# EAGLE schematic schem1 (EAGLE 8.6.0)
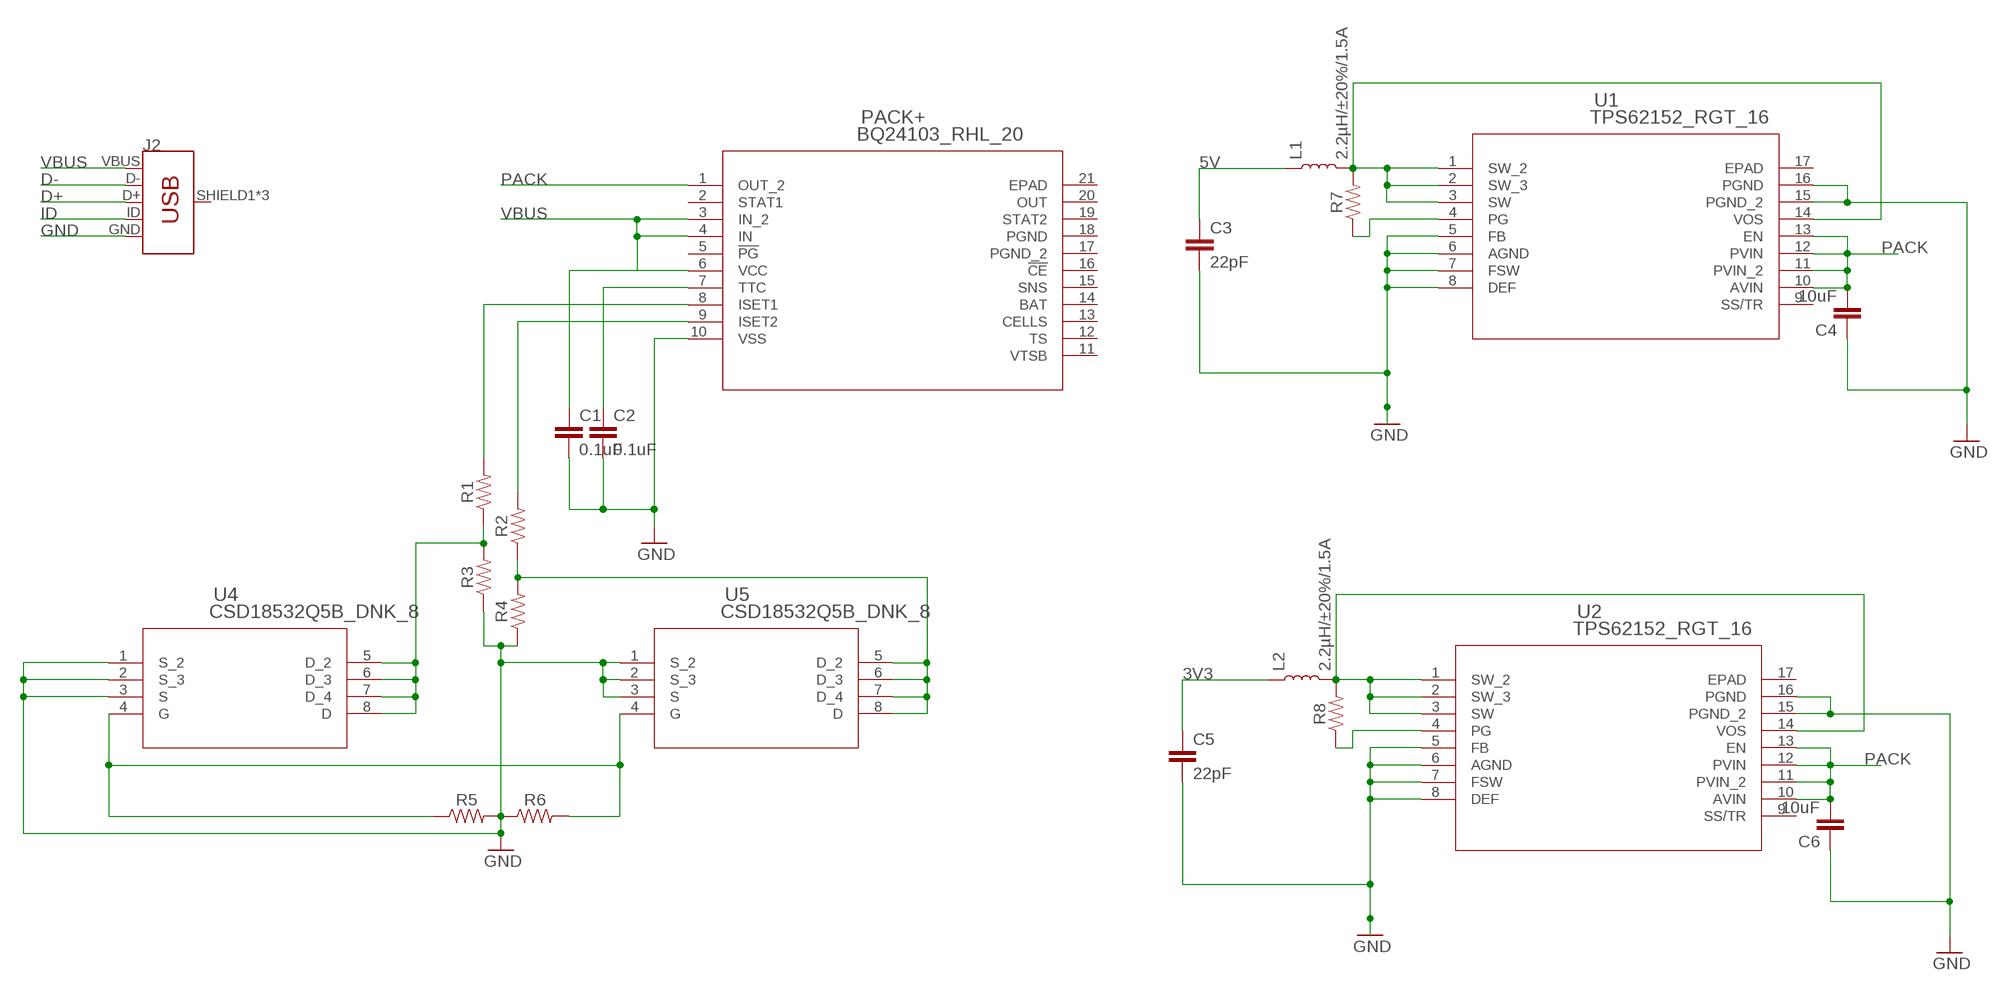
[diagram p0: schematic, sheet 1]

## Parts
C1  0.1uF  0.1UF-0603-25V-(+80/-20%)  [0603]
C2  0.1uF  0.1UF-0603-25V-(+80/-20%)  [0603]
C3  22pF  22PF-0603-50V-5%  [0603]
C4  10uF  10UF-0603-6.3V-20%  [0603]
C5  22pF  22PF-0603-50V-5%  [0603]
C6  10uF  10UF-0603-6.3V-20%  [0603]
J2  USB_MICRO-B_FEMALE-SMT  [USB-B-MICRO-SMD]
L1  2.2µH/±20%/1.5A  INDUCTOR-VLF4012AT-2.2UH  [INDUCTOR_2.2UH]
L2  2.2µH/±20%/1.5A  INDUCTOR-VLF4012AT-2.2UH  [INDUCTOR_2.2UH]
PACK+  BQ24103_RHL_20  [RHL20_2P05X3P05]
R1  RESISTOR0603  [0603]
R2  RESISTOR0603  [0603]
R3  RESISTOR0603  [0603]
R4  RESISTOR0603  [0603]
R5  RESISTOR0603  [0603]
R6  RESISTOR0603  [0603]
R7  RESISTOR0603  [0603]
R8  RESISTOR0603  [0603]
U1  TPS62152_RGT_16  [RGT16_1P7X1P7]
U2  TPS62152_RGT_16  [RGT16_1P7X1P7]
U4  CSD18532Q5B_DNK_8  [DNK8]
U5  CSD18532Q5B_DNK_8  [DNK8]

## Nets
3V3: C5.1 L2.P$1
5V: C3.1 L1.P$1
D+: J2.D+
D-: J2.D-
GND: C1.2 C2.2 C3.2 C4.1 C5.2 C6.1 J2.GND PACK+.10(VSS) R3.1 R4.1 R5.2 R6.1 U1.5(FB) U1.6(AGND) U1.7(FSW) U1.8(DEF) U1.15(PGND_2) U1.16(PGND) U2.5(FB) U2.6(AGND) U2.7(FSW) U2.8(DEF) U2.15(PGND_2) U2.16(PGND) U4.1(S_2) U4.2(S_3) U4.3(S) U5.1(S_2) U5.2(S_3) U5.3(S)
ID: J2.ID
N$1: R1.1 R3.2 U4.5(D_2) U4.6(D_3) U4.7(D_4) U4.8(D)
N$2: R2.1 R4.2 U5.5(D_2) U5.6(D_3) U5.7(D_4) U5.8(D)
N$3: L2.P$2 R8.2 U2.1(SW_2) U2.2(SW_3) U2.3(SW) U2.14(VOS)
N$4: R5.1 R6.2 U4.4(G) U5.4(G)
N$6: R7.1 U1.4(PG)
N$7: PACK+.9(ISET2) R2.2
N$8: L1.P$2 R7.2 U1.1(SW_2) U1.2(SW_3) U1.3(SW) U1.14(VOS)
N$9: C2.1 PACK+.7(TTC)
N$10: PACK+.8(ISET1) R1.2
N$12: R8.1 U2.4(PG)
PACK: C4.2 C6.2 PACK+.1(OUT_2) U1.10(AVIN) U1.11(PVIN_2) U1.12(PVIN) U1.13(EN) U2.10(AVIN) U2.11(PVIN_2) U2.12(PVIN) U2.13(EN)
VBUS: C1.1 J2.VBUS PACK+.3(IN_2) PACK+.4(IN) PACK+.6(VCC)
Unconnected: J2.SHIELD1(SHIELD) J2.SHIELD2(SHIELD) J2.SHIELD3(SHIELD) PACK+.2(STAT1) PACK+.5(!PG) PACK+.11(VTSB) PACK+.12(TS) PACK+.13(CELLS) PACK+.14(BAT) PACK+.15(SNS) PACK+.16(!CE) PACK+.19(STAT2) PACK+.20(OUT) PACK+.21(EPAD) U1.9(SS/TR) U1.17(EPAD) U2.9(SS/TR) U2.17(EPAD)

## Power pins joined to a net without a drawn wire
PGND: PACK+.18(PGND)
PGND_2: PACK+.17(PGND_2)

## Library data of the parts
C1 C2 = power_module:0.1UF: 0.1µF ceramic capacitors A capacitor is a passive two-terminal electrical component used to store electrical energy temporarily in an electric field.; PROD_ID: CAP-00810
C3 C5 = power_module:22PF: 22pF ceramic capacitors A capacitor is a passive two-terminal electrical component used to store electrical energy temporarily in an electric field.; PROD_ID: CAP-07876
C4 C6 = power_module:10UF: 10.0µF ceramic capacitors A capacitor is a passive two-terminal electrical component used to store electrical energy temporarily in an electric field.; PROD_ID: CAP-11015
J2 = power_module:USB_MICRO-B: USB Type Micro-B Connector Male/female and PTH/SMT variants SparkFun Products: SparkFun microB USB Breakout <https://www.sparkfun.com/products/12035> SparkFun USB microB Plug Breakout <https://www.sparkfun.com/products/10031> SparkFun ESP8266 Thing <https://www.sparkfun.com/products/13231>; PROD_ID: CONN-11752
L1 L2 = power_module:INDUCTOR: Inductors Resist changes in electrical current. Basically a coil of wire. SparkFun Products: SparkFun Load Cell Amplifier - HX711 <https://www.sparkfun.com/products/13879> IOIO-OTG - V2.2 <https://www.sparkfun.com/products/13613>; PROD_ID: NDUC-09513
PACK+ = power_module:BQ24103_RHL_20
R1-R8 = power_module:RESISTOR: Generic Resistor Package
U1 U2 = power_module:TPS62152_RGT_16; MANUFACTURER_PART_NUMBER: tps62152_rgt_16; VENDOR: Texas Instruments
U4 U5 = power_module:CSD18532Q5B_DNK_8; MANUFACTURER_PART_NUMBER: csd18532q5b_dnk_8; VENDOR: TEXAS INSTRUMENTS